# EasyEDA Pro project ProPrj_无线即时通信_2025-03-31.epro, schematic Schematic2
Create Date: 2024-08-25; Page Name: P1; Project Name: 无线即时通信; Schematic Name: Schematic2; Update Date: 2024-08-25; Company: 嘉立创EDA; Page Size: A5; Version: V1.0
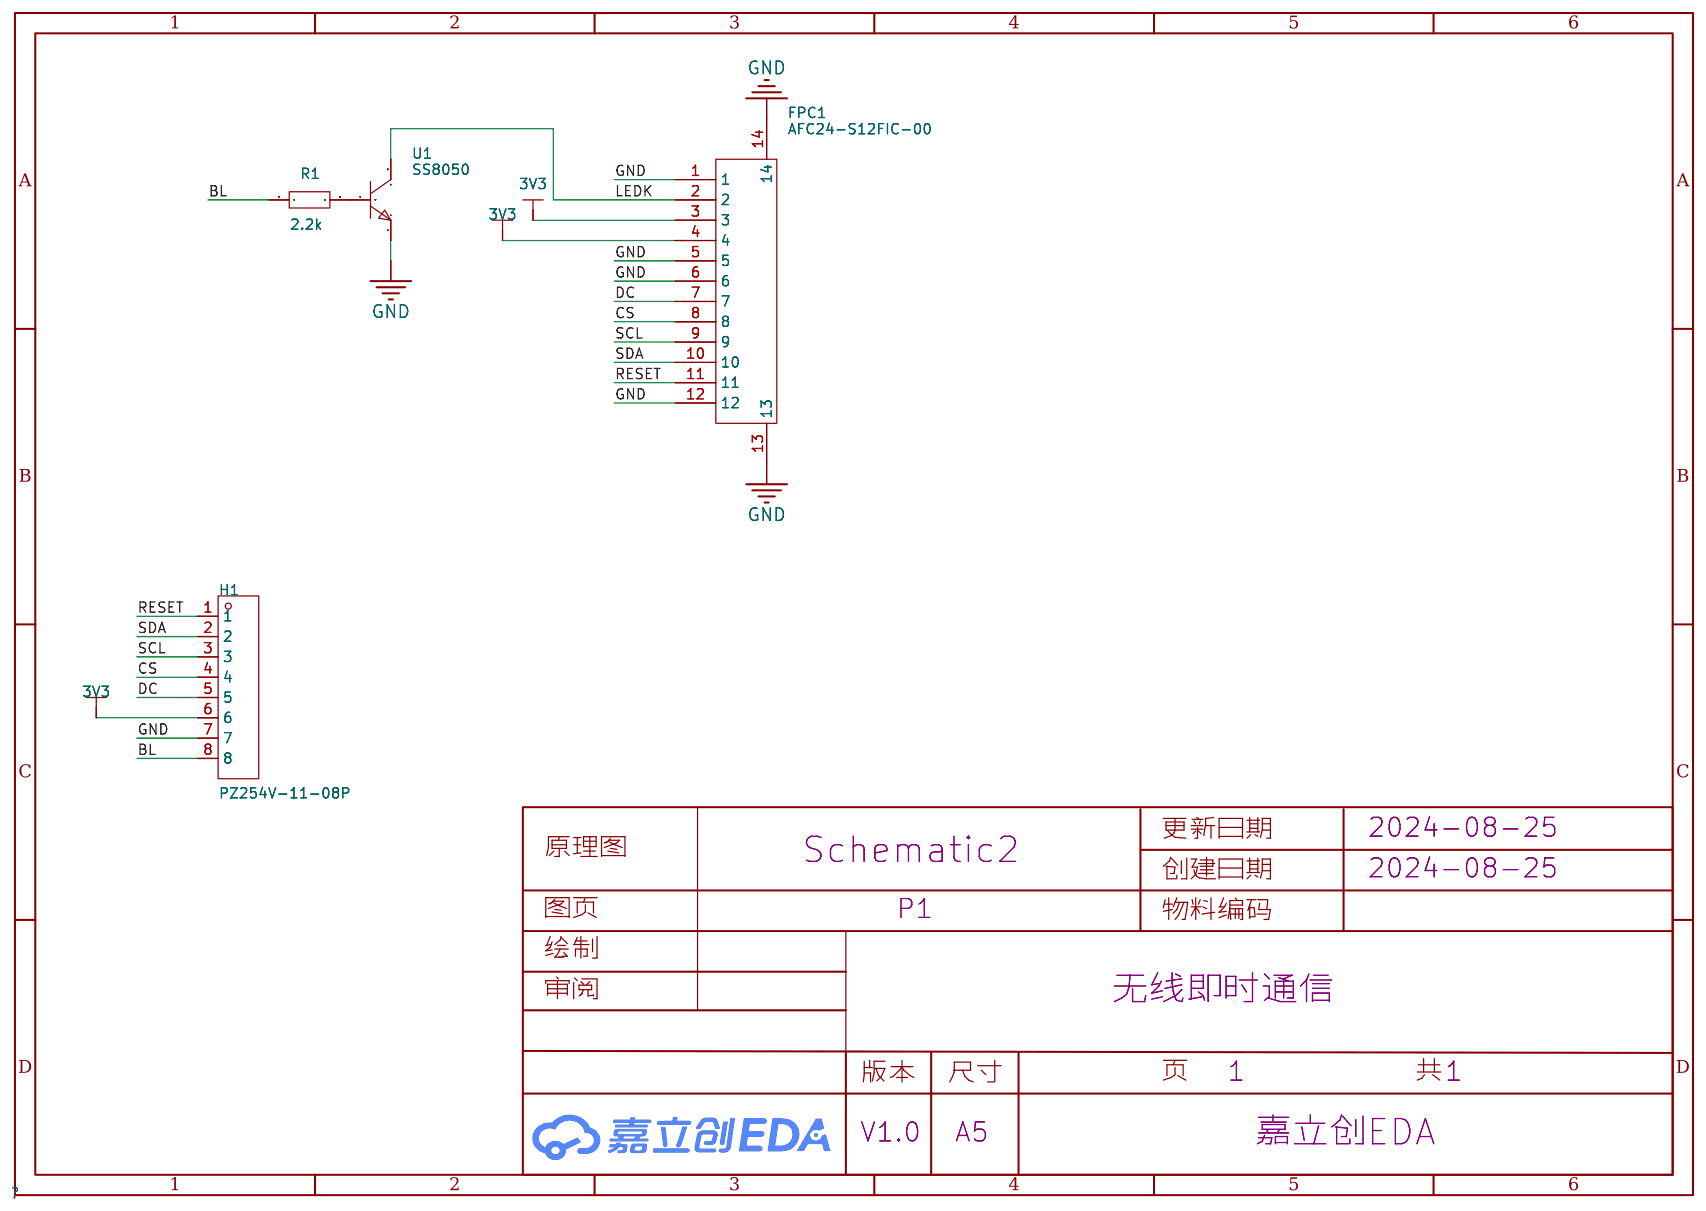
[diagram p0: schematic sheet]

## Parts
FPC1  AFC24-S12FIC-00  [FPC-SMD_P0.50-12P_QCHF-SM-H2.0]
H1  PZ254V-11-08P  [HDR-TH_8P-P2.54-V-M]
R1  2.2k  [R0603]
U1  SS8050  [SOT-23-3_L2.9-W1.3-P1.90-LS2.4-BR]

## Library data of the parts
FPC1 = AFC24-S12FIC-00: 锁定特性:翻盖式;触点类型:双侧触点/上下接;触点数量:12P;间距:0.5mm;安装类型:卧贴;; LCSC Part Name: 间距:0.5mm P数:12P 翻盖式 双侧触点/上下接; Supplier Part: C262290; Manufacturer: JS(钜硕电子); Supplier Footprint: SMD,P=0.5mm,卧贴; JLCPCB Part Class: 扩展库; Datasheet: https://atta.szlcsc.com/upload/public/pdf/source/20180814/C262679_7FB2CAD07E71B2E22E52A118EE33337B.pdf; Supplier: LCSC; Locking Feature: 翻盖式; Contact Type: 双侧触点/上下接; Number of Contacts: 12P; Pitch: 0.5mm; Mounting Type: 卧贴; FFC, FCB Thickness: 0.3mm; Height Above Board: 2mm
H1 = PZ254V-11-08P: 插针结构:1x8P;间距:2.54mm;行距:-;圆针/方针:方针;安装类型:直插;排数:单排;总PIN位数:8P;额定电流:-;额定电压:-;配合针长度:6mm;塑高:2.5mm;端接针长度:3mm;触头材质:黄铜;触头镀层:-;工作温度范围:-40℃~+105℃;颜色:黑色;; LCSC Part Name: 间距:2.54mm 1x8P 直插 方针; Supplier Part: C492407; Manufacturer: XFCN(兴飞); Supplier Footprint: 插件,P=2.54mm; JLCPCB Part Class: 扩展库; Datasheet: https://atta.szlcsc.com/upload/public/pdf/source/20200309/C492407_83A6FB26A2233368EDB9516968EC6149.pdf; Supplier: LCSC; Pin Structure: 1x8P; Pitch: 2.54mm; Circluar Pins/Square Pins: 方针; Mounting Type: 直插; Number of Rows: 单排; Number of Pins: 8P; Length of Mating Pin: 6mm; Insulation Height: 2.5mm; Length of End Connection Pin: 3mm; Contact Material: 黄铜; Operating Temperature Range: -40℃~+105℃; Color: 黑色
R1 = Res_0603: Supplier Footprint: 0603
U1 = SS8050_C7420370: 晶体管类型:NPN;集电极电流(Ic):1.5A;集射极击穿电压(Vceo):25V;功率(Pd):300mW;直流电流增益(hFE@Ic,Vce):120@100mA,1.0V;; LCSC Part Name: 耐压:25V 电流:1.5A NPN H档 200-350; Supplier Part: C7420370; Manufacturer: 宏迦橙; Supplier Footprint: SOT-23; JLCPCB Part Class: 扩展库; Datasheet: https://atta.szlcsc.com/upload/public/pdf/source/20231222/9C4050A7669EB24B3ACD0418218817FD.pdf; Supplier: LCSC; Transistor Type: NPN; Collector Current (Ic): 1.5A; Collector-Emitter Breakdown Voltage (Vceo): 25V; Power Dissipation (Pd): 300mW; DC Current Gain (hFE@Ic,Vce): 120@100mA,1.0V; Transition Frequency (fT): 100MHz; Collector Cut-Off Current (Icbo): 100nA; Collector-Emitter Saturation Voltage (VCE(sat)@Ic,Ib): 500mV@800mA,80mA; Operating Temperature: -55℃~+150℃

## Nets
3V3: FPC1.3 FPC1.4 H1.6
GND: FPC1.1 FPC1.5 FPC1.6 FPC1.12 FPC1.13 FPC1.14 H1.7 U1.2(E)
BL: H1.8 R1.1
CS: FPC1.8 H1.4
DC: FPC1.7 H1.5
LEDK: FPC1.2 U1.3(C)
RESET: FPC1.11 H1.1
SCL: FPC1.9 H1.3
SDA: FPC1.10 H1.2
$1N486: R1.2 U1.1(B)
